# EAGLE design LCMeter_v1_1 (EAGLE 6.5.0)
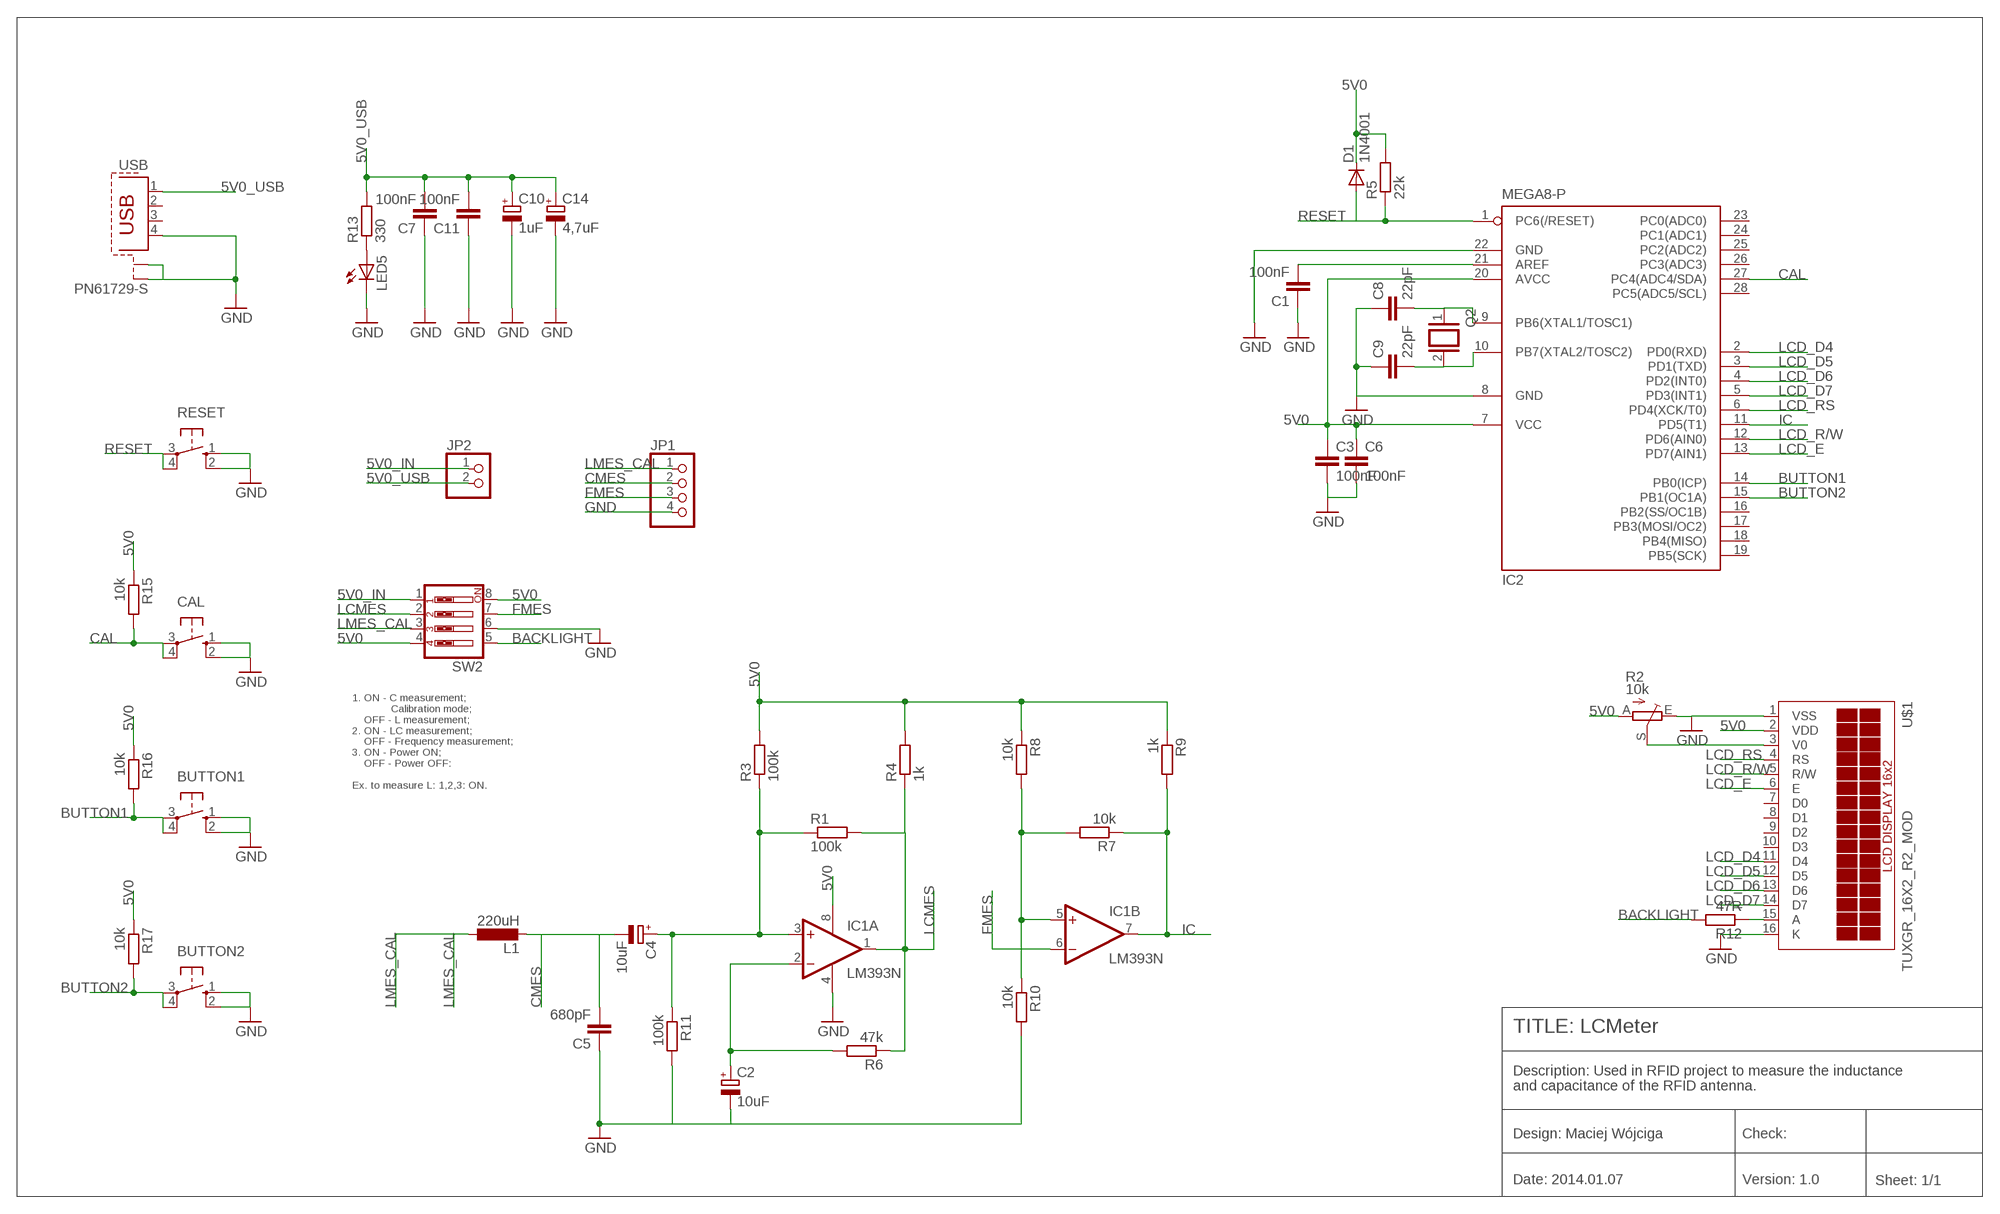
[diagram p0: schematic, sheet 1]

## Parts
BUTTON1  10-XX  [B3F-10XX]
BUTTON2  10-XX  [B3F-10XX]
C1  100nF  C-EU025-025X050  [C025-025X050]
C2  10uF  CPOL-EUE2,5-6E  [E2,5-6E]
C3  100nF  C-EU025-025X050  [C025-025X050]
C4  10uF  CPOL-EUE2,5-6E  [E2,5-6E]
C5  680pF  C-EU025-025X050  [C025-025X050]
C6  100nF  C-EU025-025X050  [C025-025X050]
C7  100nF  C-EU025-025X050  [C025-025X050]
C8  22pF  C-EU025-025X050  [C025-025X050]
C9  22pF  C-EU025-025X050  [C025-025X050]
C10  1uF  CPOL-EUE2.5-5  [E2,5-5]
C11  100nF  C-EU025-025X050  [C025-025X050]
C14  4,7uF  CPOL-EUE2.5-5  [E2,5-5]
CAL  10-XX  [B3F-10XX]
D1  1N4001  1N4004  [DO41-10]
IC1  LM393N  [DIL08]
IC2  MEGA8-P  [DIL28-3]
JP1  PINHD-1X4  [1X04]
JP2  PINHD-1X2/90  [1X02/90]
L1  220uH  L-EU6000-XXX-RC  [6000-XXXX-RC]
LED5  LED3MM  [LED3MM]
Q2  XTAL/S  [QS]
R1  100k  R-EU_0207/10  [0207/10]
R2  10k  TRIM_EU-RJ9W  [RJ9W]
R3  100k  R-EU_0207/10  [0207/10]
R4  1k  R-EU_0207/10  [0207/10]
R5  22k  R-EU_0207/10  [0207/10]
R6  47k  R-EU_0207/10  [0207/10]
R7  10k  R-EU_0207/10  [0207/10]
R8  10k  R-EU_0207/10  [0207/10]
R9  1k  R-EU_0207/10  [0207/10]
R10  10k  R-EU_0207/10  [0207/10]
R11  100k  R-EU_0207/10  [0207/10]
R12  47R  R-EU_0207/10  [0207/10]
R13  330  R-EU_0207/10  [0207/10]
R15  10k  R-EU_0207/10  [0207/10]
R16  10k  R-EU_0207/10  [0207/10]
R17  10k  R-EU_0207/10  [0207/10]
RESET  10-XX  [B3F-10XX]
SW2  SW_DIP-4  [EDG-04]
U$1  TUXGR_16X2_R2_MOD  [TUXGR_16X2_R2_MOD]
USB  PN61729-S  [PN61729-S]

## Nets
5V0: C3.1 C6.1 D1.C IC1.8(P:V+) IC2.7(VCC) IC2.20(AVCC) R2.A R3.2 R4.2 R5.2 R8.1 R9.1 R15.1 R16.1 R17.1 SW2.4 SW2.8 U$1.2(VDD)
5V0_IN: JP2.1 SW2.1
5V0_USB: C7.2 C10.+ C11.2 C14.+ JP2.2 R13.2 USB.1
BACKLIGHT: R12.2 SW2.5
BUTTON1: BUTTON1.3(P) BUTTON1.4(P1) IC2.14(PB0(ICP)) R16.2
BUTTON2: BUTTON2.3(P) BUTTON2.4(P1) IC2.15(PB1(OC1A)) R17.2
CAL: CAL.3(P) CAL.4(P1) IC2.27(PC4(ADC4/SDA)) R15.2
CMES: C4.- C5.2 JP1.2 L1.2
FMES: IC1.6(B:-IN) JP1.3 SW2.7
GND: BUTTON1.1(S) BUTTON1.2(S1) BUTTON2.1(S) BUTTON2.2(S1) C1.1 C2.- C3.2 C5.1 C6.2 C7.1 C8.1 C9.1 C10.- C11.1 C14.- CAL.1(S) CAL.2(S1) IC1.4(P:V-) IC2.8(GND) IC2.22(GND) JP1.4 LED5.K(C) R2.E R10.2 R11.2 RESET.1(S) RESET.2(S1) SW2.6 U$1.1(VSS) U$1.16(K) USB.4 USB.S1 USB.S2
IC: IC1.7(B:OUT) IC2.11(PD5(T1)) R7.1 R9.2
LCD_D4: IC2.2(PD0(RXD)) U$1.11(D4)
LCD_D5: IC2.3(PD1(TXD)) U$1.12(D5)
LCD_D6: IC2.4(PD2(INT0)) U$1.13(D6)
LCD_D7: IC2.5(PD3(INT1)) U$1.14(D7)
LCD_E: IC2.13(PD7(AIN1)) U$1.6(E)
LCD_R/W: IC2.12(PD6(AIN0)) U$1.5(R/W)
LCD_RS: IC2.6(PD4(XCK/T0)) U$1.4(RS)
LCMES: IC1.1(A:OUT) R1.2 R4.1 R6.1 SW2.2
LMES_CAL: JP1.1 L1.1 SW2.3
N$1: C1.2 IC2.21(AREF)
N$3: C2.+ IC1.2(A:-IN) R6.2
N$4: R2.S U$1.3(V0)
N$8: C4.+ IC1.3(A:+IN) R1.1 R3.1 R11.1
N$10: LED5.A R13.1
N$11: IC1.5(B:+IN) R7.2 R8.2 R10.1
N$16: R12.1 U$1.15(A)
N$29: C8.2 IC2.9(PB6(XTAL1/TOSC1)) Q2.1
N$35: C9.2 IC2.10(PB7(XTAL2/TOSC2)) Q2.2
RESET: D1.A IC2.1(PC6(/RESET)) R5.1 RESET.3(P) RESET.4(P1)
Unconnected: IC2.16(PB2(SS/OC1B)) IC2.17(PB3(MOSI/OC2)) IC2.18(PB4(MISO)) IC2.19(PB5(SCK)) IC2.23(PC0(ADC0)) IC2.24(PC1(ADC1)) IC2.25(PC2(ADC2)) IC2.26(PC3(ADC3)) IC2.28(PC5(ADC5/SCL)) U$1.7(D0) U$1.8(D1) U$1.9(D2) U$1.10(D3) USB.2 USB.3

## Notes on the sheet
- 1. ON - C measurement;
               Calibration mode;
      OFF - L measurement;
  2. ON - LC measurement;
      OFF - Frequency measurement;
  3. ON - Power ON;
      OFF - Power OFF:
  
  Ex. to measure L: 1,2,3: ON.
- TITLE: LCMeter
- Description: Used in RFID project to measure the inductance
  and capacitance of the RFID antenna.
- Design: Maciej Wójciga | Check:
- Date: 2014.01.07 | Version: 1.0 | Sheet: 1/1

## Library data of the parts
BUTTON1 BUTTON2 CAL RESET = switch-omron:10-XX: OMRON SWITCH; MPN: B3F-1000; OC_FARNELL: 176432; OC_NEWARK: 36M3542
C1 C3 C5-C9 C11 = rcl:C-EU: CAPACITOR, European symbol
C2 C4 C10 C14 = rcl:CPOL-EU: POLARIZED CAPACITOR, European symbol
D1 = diode:1N4004: DIODE general purpose rectifier, 1 A
IC1 = linear:LM393: COMPARATOR
IC2 = atmel:MEGA8-P: MICROCONTROLLER 8 Kbytes FLASH, 1 kbytes SRAM, 512 bytes EEPROM, USART, 4-channel 10 bit ADC, 2-channel 8 bit ADC Pin compatible with Atmega48, ATMega88, ATMega168 Source: avr.lbr; OC_FARNELL: unknown; OC_NEWARK: unknown
JP1 = pinhead:PINHD-1X4: PIN HEADER
JP2 = pinhead:PINHD-1X2: PIN HEADER
L1 = rcl:L-EU: INDUCTOR, European symbol
LED5 = led:LED: LED OSRAM: - CHIPLED LG R971, LG N971, LY N971, LG Q971, LY Q971, LO R971, LY R971 LH N974, LH R974 LS Q976, LO Q976, LY Q976 LO Q996 - Hyper CHIPLED LW Q18S LB Q993, LB Q99A, LB R99A - SideLED LS A670, LO A670, LY A670, LG A670, LP A670 LB A673, LV A673, LT A673, LW A673 LH A674 LY A675 LS A676, LA A676, LO A676, LY A676, LW A676 LS A679, LY A679, LG A679 - Hyper Micro SIDELED® LS Y876, LA Y876, LO Y876, LY Y876 LT Y87S - SmartLED LW L88C, LW L88S LB L89C, LB L89S, LG L890 LS L89K, LO L89K, LY L89K LS L896, LA L896, LO L896, LY L896 - TOPLED LS T670, LO T670, LY T670, LG T670, LP T670 LSG T670, LSP T670, LSY T670, LOP T670, LYG T670 LG T671, LOG T671, LSG T671 LB T673, LV T673, LT T673, LW T673 LH T674 LS T676, LA T676, LO T676, LY T676, LB T676, LH T676, LSB T676, LW T676 LB T67C, LV T67C, LT T67C, LS T67K, LO T67K, LY T67K, LW E67C LS E67B, LA E67B, LO E67B, LY E67B, LB E67C, LV E67C, LT E67C LW T67C LS T679, LY T679, LG T679 LS T770, LO T770, LY T770, LG T770, LP T770 LB T773, LV T773, LT T773, LW T773 LH T774 LS E675, LA E675, LY E675, LS T675 LS T776, LA T776, LO T776, LY T776, LB T776 LHGB T686 LT T68C, LB T68C - Hyper Mini TOPLED® LB M676 - Mini TOPLED Santana® LG M470 LS M47K, LO M47K, LY M47K Source: http://www.osram.convergy.de LUXEON: - LUMILED® LXK2-PW12-R00, LXK2-PW12-S00, LXK2-PW14-U00, LXK2-PW14-V00 LXK2-PM12-R00, LXK2-PM12-S00, LXK2-PM14-U00 LXK2-PE12-Q00, LXK2-PE12-R00, LXK2-PE12-S00, LXK2-PE14-T00, LXK2-PE14-U00 LXK2-PB12-K00, LXK2-PB12-L00, LXK2-PB12-M00, LXK2-PB14-N00, LXK2-PB14-P00, LXK2-PB14-Q00 LXK2-PR12-L00, LXK2-PR12-M00, LXK2-PR14-Q00, LXK2-PR14-R00 LXK2-PD12-Q00, LXK2-PD12-R00, LXK2-PD12-S00 LXK2-PH12-R00, LXK2-PH12-S00 LXK2-PL12-P00, LXK2-PL12-Q00, LXK2-PL12-R00 Source: www.luxeon.com KINGBRIGHT: KA-3528ASYC Source: www.kingbright.com
Q2 = special:XTAL/S: CRYSTAL
R1 R3-R13 R15-R17 = rcl:R-EU_: RESISTOR, European symbol
R2 = pot:TRIM_EU-: POTENTIOMETER
SW2 = special:SW_DIP-4: DIP SWITCH
U$1 = display-lcd:TUXGR_16X2_R2_MOD
USB = con-berg:PN61729-S: BERG USB connector; OC_FARNELL: unknown; OC_NEWARK: unknown

## Net classes
0 default: width 0.203 mm

## Board
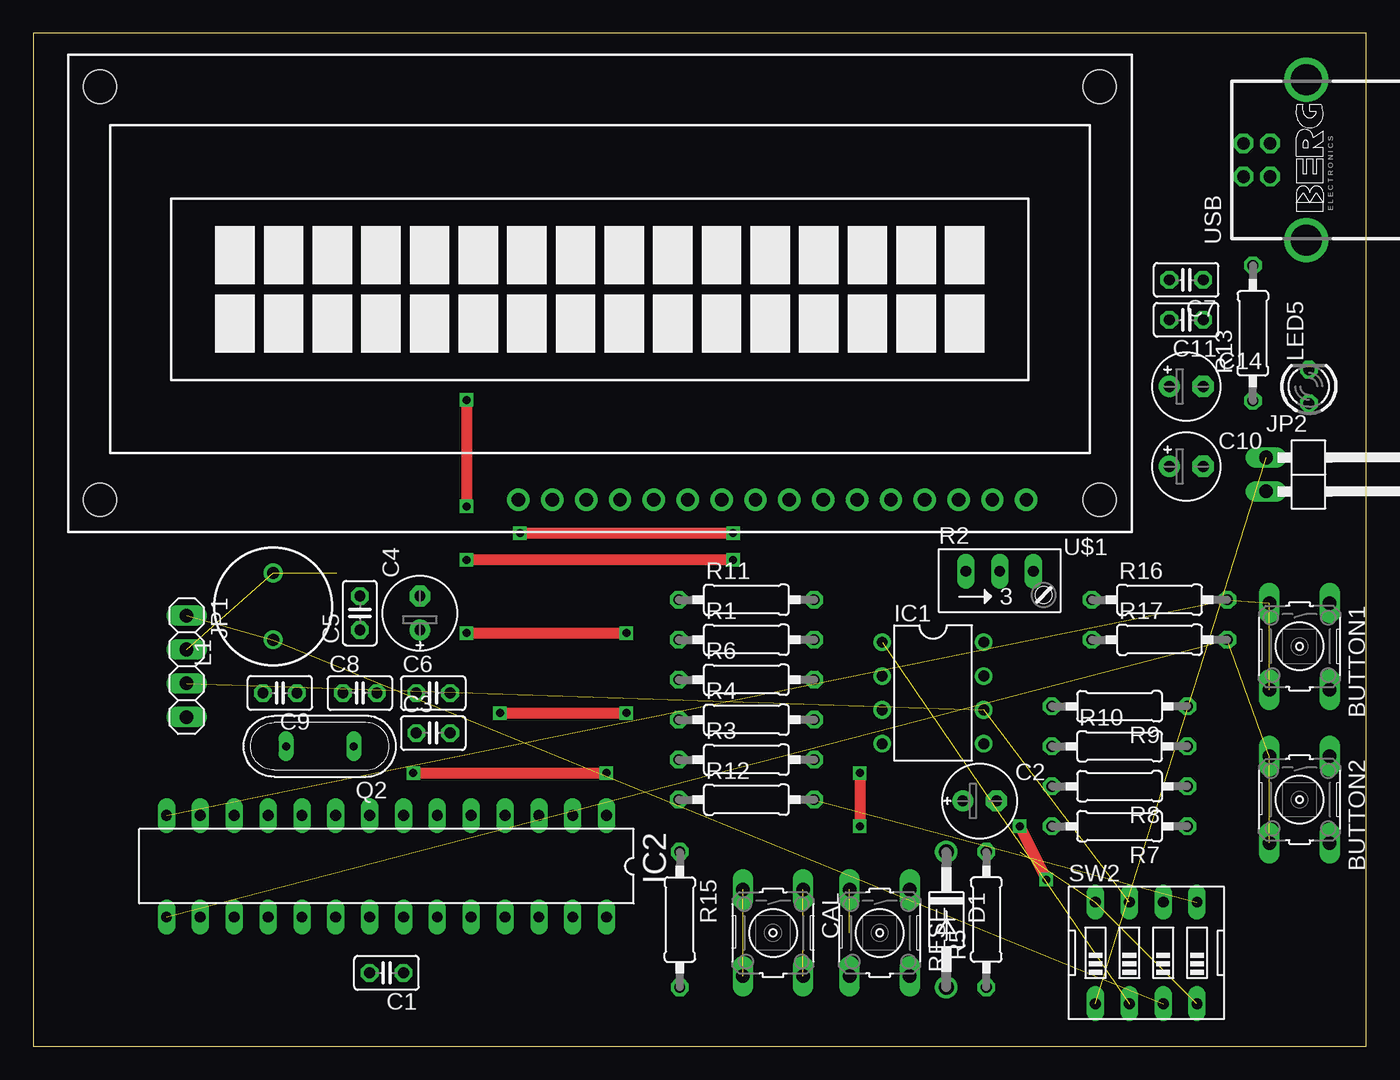
[diagram p1: board, top side]
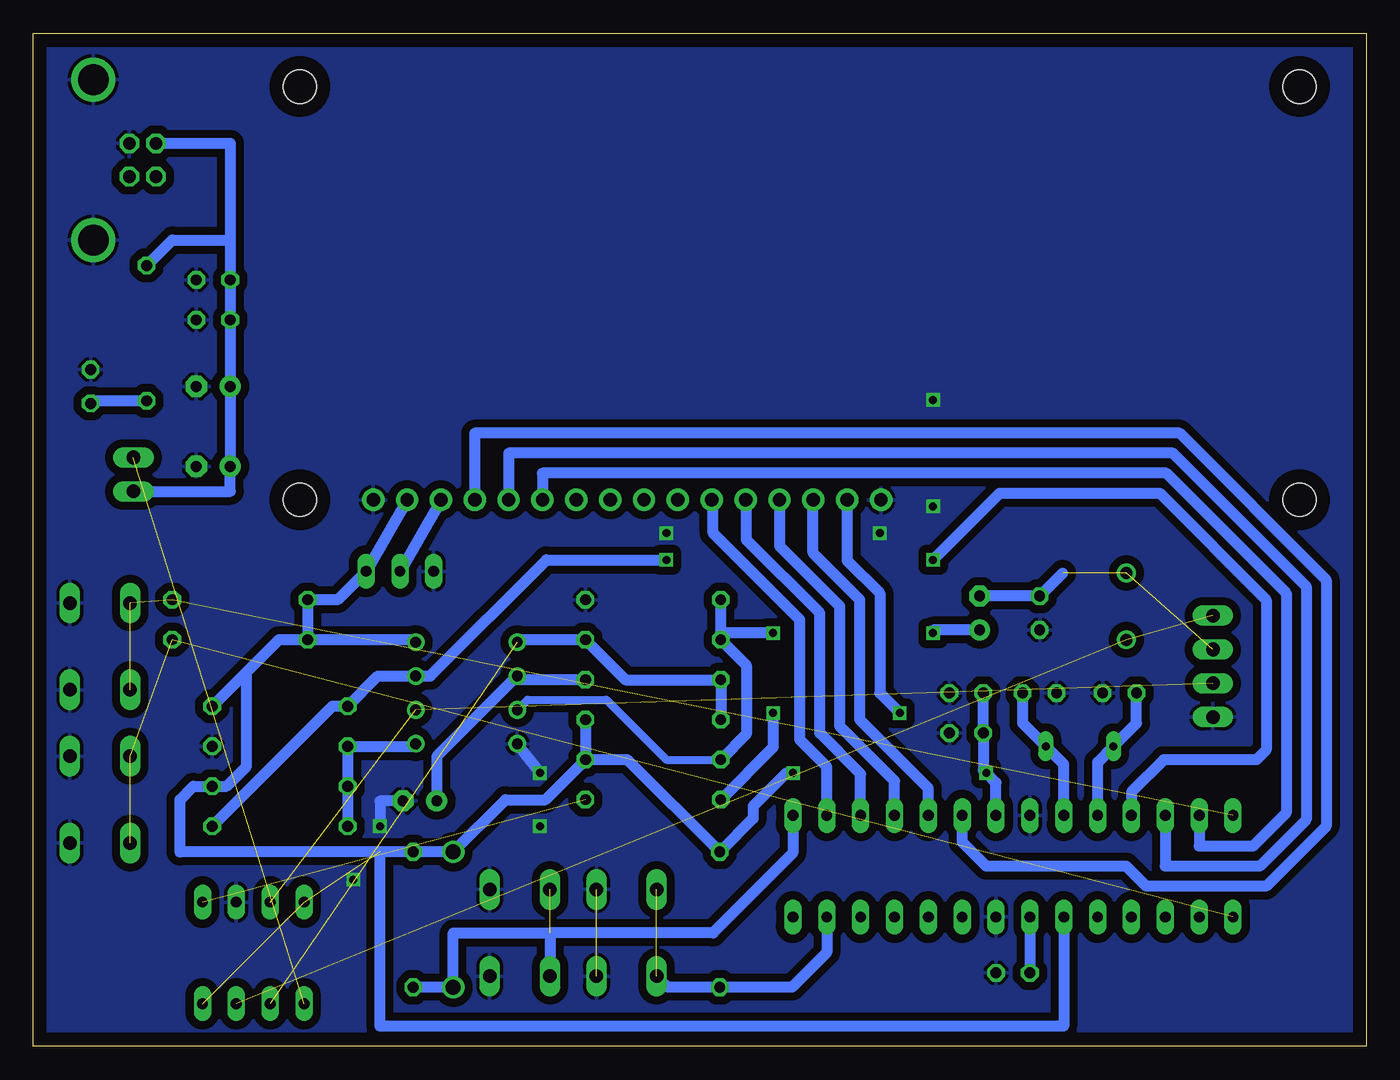
[diagram p2: board, bottom side, seen from below]

Size 100 x 76 mm. Coordinates in mm from the lower left corner, seen from the top.
Outline: 0,0 100,0 100,76 0,76 0,0
Copper layers (1*16): Top 0.035mm / dielectric 1.5mm / Bottom 0.035mm
Design rules "default": minimum track width 10mil, minimum drill 24mil, track to track 8mil, track to pad 8mil, pad to pad 8mil, via to via 8mil, smd to smd 8mil, copper to edge 40mil, drill to drill 8mil, minimum pad ring 10mil, minimum via ring 8mil, stop-mask expansion 4mil, vias tented up to drill 0mil, thermal gap 10mil

### Footprints (pad centres in the part's own frame; a part is rotated, then mirrored left to right if it is on the bottom)
B3F-10XX = drill 1.016 long: 1 -3.251,2.261; 2 3.251,2.261; 3 -3.251,-2.261; 4 3.251,-2.261
C025-025X050 = drill 0.813 octagon: 1 -1.27,0; 2 1.27,0
E2,5-6E = drill 0.813 pad 1.575: + -1.27,0 | drill 0.813 pad 1.575 octagon: - 1.27,0
E2,5-5 = drill 0.813 pad 1.6: + -1.27,0 | drill 0.813 pad 1.6 octagon: - 1.27,0
DO41-10 = drill 1.118: A 5.08,0; C -5.08,0
DIL08 = drill 0.813 pad 1.27: 1 -3.81,-3.81; 2 -1.27,-3.81; 3 1.27,-3.81; 4 3.81,-3.81; 5 3.81,3.81; 6 1.27,3.81; 7 -1.27,3.81; 8 -3.81,3.81
DIL28-3 = drill 0.813 long: 1 -16.51,-3.81; 2 -13.97,-3.81; 3 -11.43,-3.81; 4 -8.89,-3.81; 5 -6.35,-3.81; 6 -3.81,-3.81; 7 -1.27,-3.81; 8 1.27,-3.81; 9 3.81,-3.81; 10 6.35,-3.81; 11 8.89,-3.81; 12 11.43,-3.81; 13 13.97,-3.81; 14 16.51,-3.81; 15 16.51,3.81; 16 13.97,3.81; 17 11.43,3.81; 18 8.89,3.81; 19 6.35,3.81; 20 3.81,3.81; 21 1.27,3.81; 22 -1.27,3.81; 23 -3.81,3.81; 24 -6.35,3.81; 25 -8.89,3.81; 26 -11.43,3.81; 27 -13.97,3.81; 28 -16.51,3.81
1X04 = drill 1.016 long: 1 -3.81,0; 2 -1.27,0; 3 1.27,0; 4 3.81,0
1X02/90 = drill 1.016 long: 1 -1.27,-3.81; 2 1.27,-3.81
6000-XXXX-RC = drill 0.9 pad 1.422: 1 -2.5,0; 2 2.5,0
LED3MM = drill 0.813 octagon: A -1.27,0; K 1.27,0
QS = drill 0.61 long: 1 -2.54,0; 2 2.54,0
0207/10 = drill 0.813 octagon: 1 -5.08,0; 2 5.08,0
RJ9W = drill 0.813 long: A 2.54,0.635; E -2.54,0.635; S 0,0.635
EDG-04 = drill 0.813 long: 1 -3.81,-3.81; 2 -1.27,-3.81; 3 1.27,-3.81; 4 3.81,-3.81; 5 3.81,3.81; 6 1.27,3.81; 7 -1.27,3.81; 8 -3.81,3.81
TUXGR_16X2_R2_MOD = drill 1 pad 1.676: 1 -32,15.5; 2 -29.46,15.5; 3 -26.92,15.5; 4 -24.38,15.5; 5 -21.84,15.5; 6 -19.3,15.5; 7 -16.76,15.5; 8 -14.22,15.5; 9 -11.68,15.5; 10 -9.14,15.5; 11 -6.6,15.5; 12 -4.06,15.5; 13 -1.52,15.5; 14 1.02,15.5; 15 3.56,15.5; 16 6.1,15.5 | hole 2.5: -37.5,-15.5; 37.5,-15.5; -37.5,15.5; 37.5,15.5
PN61729-S = drill 0.95 octagon: 1 1.25,4.71; 2 -1.25,4.71; 3 -1.25,2.71; 4 1.25,2.71 | drill 2.3 pad 2.9: S1 -6.02,0; S2 6.02,0

### Placement (x,y rotation side)
BUTTON1  95,30 270 top
BUTTON2  95,18.5 270 top
C1  26.5,5.5 180 top
C2  71,18.4 0 top
C3  30,23.5 0 top
C4  29,32.5 90 top
C5  24.5,32.5 90 top
C6  30,26.5 0 top
C7  86.5,57.5 180 top
C8  24.5,26.5 0 top
C9  18.5,26.5 180 top
C10  86.5,43.5 0 top
C11  86.5,54.5 180 top
C14  86.5,49.5 0 top
CAL  55.5,8.5 270 top
D1  68.5,9.5 270 top
IC1  67.5,26.5 270 top
IC2  26.5,13.5 180 top
JP1  11.5,28.5 270 top
JP2  96.3,42.9 270 top
L1  18,33 90 top
LED5  95.7,49.5 90 top
Q2  21.5,22.5 180 top
R1  53.5,30.5 0 top
R2  72.5,35 0 top
R3  53.5,21.5 0 top
R4  53.5,24.5 0 top
R5  71.5,9.5 90 top
R6  53.5,27.5 0 top
R7  81.5,16.5 180 top
R8  81.5,19.5 180 top
R9  81.5,25.5 180 top
R10  81.5,22.5 0 top
R11  53.5,33.5 0 top
R12  53.5,18.5 0 top
R13  91.5,53.5 90 top
R15  48.5,9.5 270 top
R16  84.5,33.5 0 top
R17  84.5,30.5 0 top
RESET  63.5,8.5 270 top
SW2  83.5,7 0 top
U$1  42.5,56.5 180 top
USB  95.5,66.5 90 top

### Tracks (layer width: path | path; a pad name or v marks a point on that pad's centre or on a via)
5V0  (via drill 0.6)  (2 unrouted)
  Top 0.813: v28.5,20.5 v43,20.5
  Bottom 0.813: R4.2 R3.2 | 74,14.58 R5.2 D1.C 64.58,18.5 61.58,18.5 R3.2 | 74,14.58 89,14.58 89,18.5 88,19.5 R8.1 85.5,19.5 84,21 84,28.08 | IC2.20 22.69,1.5 74,1.5 74,14.58 | IC2.7 27.77,19.77 v28.5,20.5 28.73,20.73 C3.1 C6.1 | v43,20.5 43.5,20.5 46,18 46,17.08 R15.1 55.42,21.5 R3.2 | U$1.2 R2.A 77.17,33.5 R16.1 R17.1 | IC1.8 71.5,30.5 R17.1 | R17.1 81.58,30.5 84,28.08 | 84,28.08 R9.1
5V0_IN  (1 unrouted)
5V0_USB
  Bottom 0.813: USB.1 85.23,67.75 85.23,60.5 | 85.23,60.5 C7.2 C11.2 C14.+ C10.+ 85.23,41.63 JP2.2 | R13.2 89.58,60.5 85.23,60.5
BACKLIGHT  (1 unrouted)
BUTTON1  (3 unrouted)
BUTTON2  (3 unrouted)
CAL  (1 unrouted)
  Bottom 0.813: IC2.27 40.47,7.03 43.08,4.42 R15.2 52.41,4.42 CAL.4
CMES  (2 unrouted)
  Bottom 0.813: 22.77,35.5 C5.2 C4.-
FMES  (2 unrouted)
GND  (via drill 0.6)  (1 unrouted)
  Top 0.813: v74,16.5 v76,12.5 | v62,20.5 v62,16.5 | v32.5,48.5 v32.5,40.5 | v36.5,38.5 v52.5,38.5
  Bottom 0.813: C2.- 74,18.4 v74,16.5 | IC1.4 v62,20.5
  pour Bottom (isolate 0.61): 0,76 100,76 100,0 0,0
IC  (via drill 0.6)
  Top 0.813: v52.5,36.5 v32.5,36.5
  Bottom 0.813: R7.1 77.58,25.5 R9.2 74.15,27.77 IC1.7 70.23,27.77 61.5,36.5 v52.5,36.5 | v32.5,36.5 27.5,41.5 15.5,41.5 7.5,33.5 7.5,22.23 8.23,21.5 15.19,21.5 17.61,19.08 IC2.11
LCD_D4
  Bottom 0.813: IC2.2 40.47,20.97 42.5,23 42.5,32 49,38.5 49,40.9 U$1.11
LCD_D5
  Bottom 0.813: IC2.3 37.93,20.43 41,23.5 41,32.5 46.5,38 46.5,40.94 U$1.12
LCD_D6
  Bottom 0.813: IC2.4 35.39,19.89 39.5,24 39.5,33 44,37.5 44,40.98 U$1.13
LCD_D7
  Bottom 0.813: IC2.5 32.85,19.35 38,24.5 38,33.5 41.5,37 41.5,40.98 U$1.14
LCD_E
  Bottom 0.813: IC2.13 12.53,15 8.5,15 6,17.5 6,34 15,43 61.8,43 U$1.6
LCD_R/W
  Bottom 0.813: IC2.12 15.07,13.5 8,13.5 4.5,17 4.5,34.5 14.5,44.5 64.34,44.5 U$1.5
LCD_RS
  Bottom 0.813: U$1.4 66.88,46 14,46 3,35 3,16.5 7.5,12 16.5,12 18,13.5 28.5,13.5 30.31,15.31 IC2.6
LCMES  (1 unrouted)
  Bottom 0.813: IC1.1 63.5,30.5 R1.2 55.58,27.5 R6.1 R4.1
LMES_CAL  (2 unrouted)
N$1
  Bottom 0.813: IC2.21 C1.2
N$3
  Bottom 0.813: R6.2 63.42,27.5 IC1.2 69.73,21.73 C2.+
N$4
  Bottom 0.813: U$1.3 R2.S
N$8  (via drill 0.6)
  Top 0.813: v32.5,31 v44.5,31
  Bottom 0.61: IC1.3 62.92,26 57,26 52.5,21.5 R3.1
  Bottom 0.813: R1.1 46.5,28.58 46.5,23.42 R3.1 | R1.1 R11.1 | C4.+ 32.5,31.23 v32.5,31 | v44.5,31 48.42,31 R1.1
N$10
  Bottom 0.813: R13.1 95.7,48.42 LED5.A
N$11
  Bottom 0.813: R7.2 R8.2 R10.1 71.5,22.5 IC1.5
N$16  (via drill 0.6)
  Top 0.813: v35,25 v44.5,25
  Bottom 0.813: U$1.15 38.94,36.44 36.5,34 36.5,26.5 v35,25 | v44.5,25 44.5,22.42 R12.1
N$29
  Bottom 0.813: IC2.9 22.69,21.15 Q2.1 25.77,24.23 C8.2
N$35
  Bottom 0.813: IC2.10 20.15,21.31 Q2.2 17.23,24.23 C9.2
RESET  (1 unrouted)
  Bottom 0.813: R5.1 D1.A 68.5,8.5 61.24,8.5 | IC2.1 43.01,14.49 49,8.5 61.24,8.5 | 61.24,8.5 RESET.4